# EAGLE design Gamma PIN V2 (EAGLE 9.0.1)
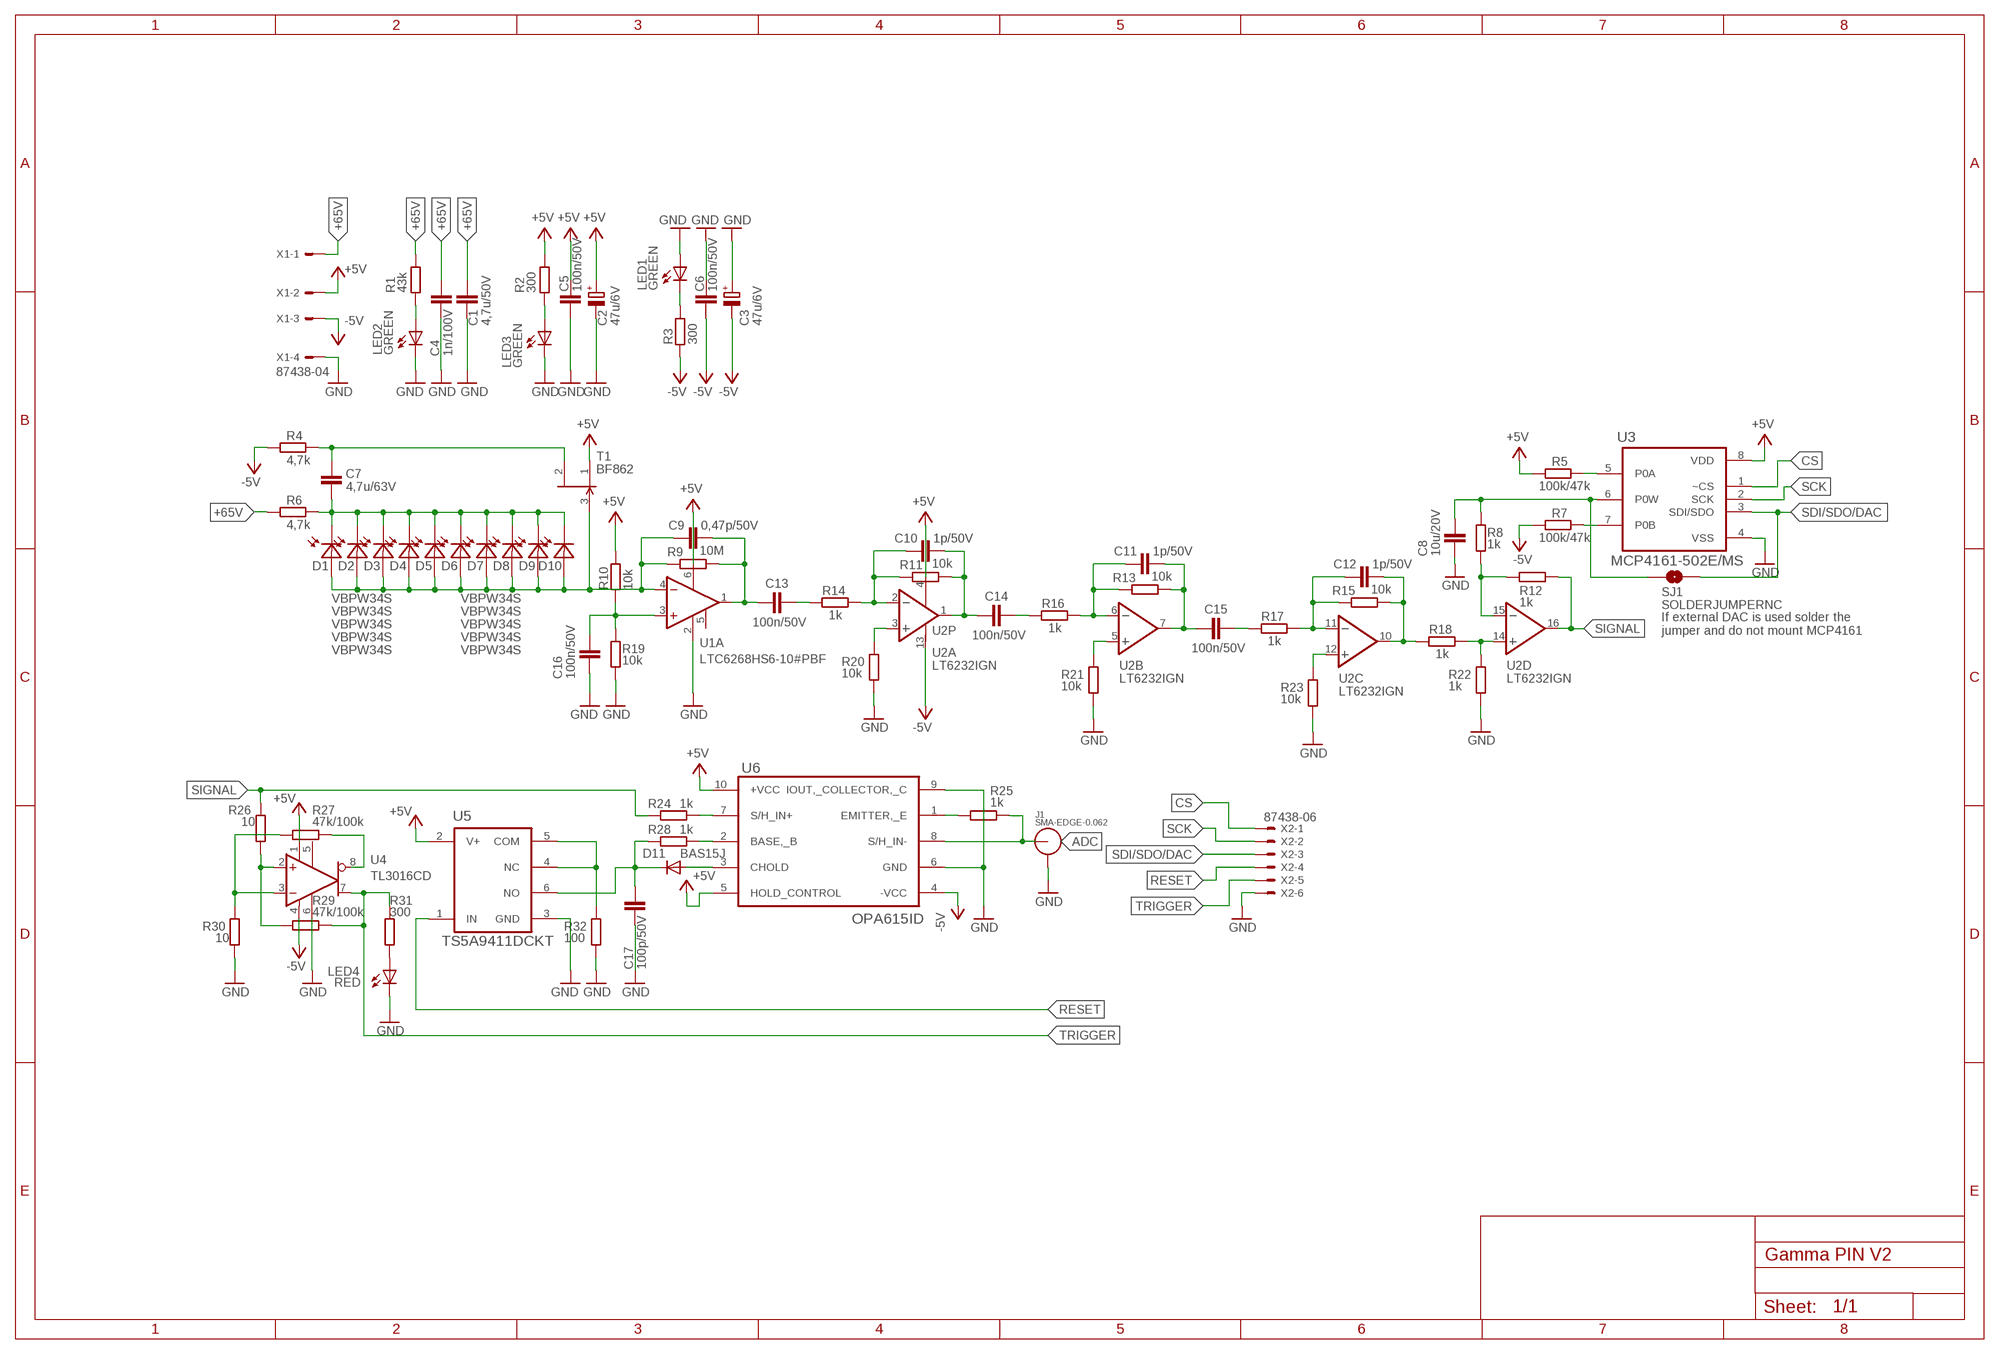
[diagram p0: schematic, sheet 1]

## Parts
C1  4,7u/50V  C-EUC1206  [C1206]
C2  47u/6V  CPOL-EUSMCB  [SMC_B]
C3  47u/6V  CPOL-EUSMCB  [SMC_B]
C4  1n/100V  C-EUC0603  [C0603]
C5  100n/50V  C-EUC0603  [C0603]
C6  100n/50V  C-EUC0603  [C0603]
C7  4,7u/63V  C-EUC1206  [C1206]
C8  10u/20V  C-EUC0603  [C0603]
C9  0,47p/50V  C-EUC0603  [C0603]
C10  1p/50V  C-EUC0603  [C0603]
C11  1p/50V  C-EUC0603  [C0603]
C12  1p/50V  C-EUC0603  [C0603]
C13  100n/50V  C-EUC0603  [C0603]
C14  100n/50V  C-EUC0603  [C0603]
C15  100n/50V  C-EUC0603  [C0603]
C16  100n/50V  C-EUC0603  [C0603]
C17  100p/50V  C-EUC0603  [C0603]
D1  VBPW34S  [SOD6439X130N]
D2  VBPW34S  [SOD6439X130N]
D3  VBPW34S  [SOD6439X130N]
D4  VBPW34S  [SOD6439X130N]
D5  VBPW34S  [SOD6439X130N]
D6  VBPW34S  [SOD6439X130N]
D7  VBPW34S  [SOD6439X130N]
D8  VBPW34S  [SOD6439X130N]
D9  VBPW34S  [SOD6439X130N]
D10  VBPW34S  [SOD6439X130N]
D11  BAS15J  DIODE-SC79_INFINEON  [SC79_INFINEON]
J1  SMA-EDGE-0.062  LINX-SMA-EDGE-0.062  [CONSMA003.062]
LED1  GREEN  LEDCHIPLED_0603  [CHIPLED_0603]
LED2  GREEN  LEDCHIPLED_0603  [CHIPLED_0603]
LED3  GREEN  LEDCHIPLED_0603  [CHIPLED_0603]
LED4  RED  LEDCHIPLED_0603  [CHIPLED_0603]
R1  43k  R-EU_R0603  [R0603]
R2  300  R-EU_R0603  [R0603]
R3  300  R-EU_R0603  [R0603]
R4  4,7k  R-EU_R0603  [R0603]
R5  100k/47k  R-EU_R0603  [R0603]
R6  4,7k  R-EU_R0603  [R0603]
R7  100k/47k  R-EU_R0603  [R0603]
R8  1k  R-EU_R0603  [R0603]
R9  10M  R-EU_R0603  [R0603]
R10  10k  R-EU_R0603  [R0603]
R11  10k  R-EU_R0603  [R0603]
R12  1k  R-EU_R0603  [R0603]
R13  10k  R-EU_R0603  [R0603]
R14  1k  R-EU_R0603  [R0603]
R15  10k  R-EU_R0603  [R0603]
R16  1k  R-EU_R0603  [R0603]
R17  1k  R-EU_R0603  [R0603]
R18  1k  R-EU_R0603  [R0603]
R19  10k  R-EU_R0603  [R0603]
R20  10k  R-EU_R0603  [R0603]
R21  10k  R-EU_R0603  [R0603]
R22  1k  R-EU_R0603  [R0603]
R23  10k  R-EU_R0603  [R0603]
R24  1k  R-EU_R0603  [R0603]
R25  1k  R-EU_R0603  [R0603]
R26  10  R-EU_R0603  [R0603]
R27  47k/100k  R-EU_R0603  [R0603]
R28  1k  R-EU_R0603  [R0603]
R29  47k/100k  R-EU_R0603  [R0603]
R30  10  R-EU_R0603  [R0603]
R31  300  R-EU_R0603  [R0603]
R32  100  R-EU_R0603  [R0603]
SJ1  SOLDERJUMPERNC  [SJ_2S_SMALL]
T1  BF862  [SOT23]
U1  LTC6268HS6-10#PBF  LTC6268HS6-10#PBFTSOT-23  [TSOT23-6]
U2  LT6232IGN  [SSOP16]
U3  MCP4161-502E/MS  [MSOP8]
U4  TL3016CD  [TSSOP8]
U5  TS5A9411DCKT  [SOT65P210X110-6N]
U6  OPA615ID  [MSOP10]
X1  87438-04  [87438-04]
X2  87438-06  [87438-06]

## Nets
+5V: C2.+ C5.2 R2.2 R5.1 R10.2 T1.1(S) U1.6(VDD) U2.4(P:V+) U3.8(VDD) U4.1(V+) U5.2(V+) U6.5(HOLD_CONTROL) U6.10(+VCC) X1.2
+65V: C1.1 C4.2 R1.2 R6.1 X1.1
-5V: C3.- C6.1 R3.1 R4.1 R7.1 U2.13(P:V-) U4.4(V-) U6.4(-VCC) X1.3
ADC: J1.ANT R25.1 U6.8(S/H_IN-)
CS: U3.1(~CS) X2.1
GND: C1.2 C2.- C3.+ C4.1 C5.1 C6.2 C8.2 C16.1 C17.1 J1.GND1 J1.GND2 J1.GND3 J1.GND4 LED1.A LED2.C LED3.C LED4.C R19.1 R20.2 R21.2 R22.2 R23.2 R30.1 R32.2 U1.2(GND) U3.4(VSS) U4.6(GND) U5.3(GND) U6.6(GND) U6.9(IOUT,_COLLECTOR,_C) X1.4 X2.6
N$1: R8.2 R12.2 U2.15(D:-IN)
N$2: C7.2 R4.2 T1.2(D)
N$3: C16.2 R10.1 R19.2 U1.3(A:+IN)
N$4: C7.1 D1.C D2.C D3.C D4.C D5.C D6.C D7.C D8.C D9.C D10.C R6.2
N$5: R27.2 R30.2 U4.3(-IN)
N$6: C9.2 D1.A D2.A D3.A D4.A D5.A D6.A D7.A D8.A D9.A D10.A R9.2 T1.3(G) U1.4(A:-IN)
N$7: C9.1 C13.2 R9.1 U1.1(A:OUT)
N$8: C13.1 R14.2
N$9: C15.1 R17.2
N$10: C12.1 R15.1 R18.2 U2.10(C:OUT)
N$11: C14.1 R16.2
N$12: R20.1 U2.3(A:+IN)
N$13: C10.2 R11.2 R14.1 U2.2(A:-IN)
N$14: C10.1 C14.2 R11.1 U2.1(A:OUT)
N$15: C11.2 R13.2 R16.1 U2.6(B:-IN)
N$16: R18.1 R22.1 U2.14(D:+IN)
N$17: C11.1 C15.2 R13.1 U2.7(B:OUT)
N$18: R21.1 U2.5(B:+IN)
N$19: C12.2 R15.2 R17.1 U2.11(C:-IN)
N$20: C8.1 R8.1 SJ1.1 U3.6(P0W)
N$21: R23.1 U2.12(C:+IN)
N$22: R5.2 U3.5(P0A)
N$23: R7.2 U3.7(P0B)
N$24: R24.1 U6.7(S/H_IN+)
N$25: D11.A U6.3(CHOLD)
N$26: R28.1 U6.2(BASE,_B)
N$27: LED2.A R1.1
N$28: LED4.A R31.1
N$29: LED3.A R2.1
N$30: LED1.C R3.2
N$31: R32.1 U5.4(NC) U5.5(COM)
N$35: R25.2 U6.1(EMITTER,_E)
N$40: R27.1 U4.8(*QOUT)
N$41: R26.2 R29.2 U4.2(+IN)
N$43: C17.2 D11.C R28.2 U5.6(NO)
RESET: U5.1(IN) X2.4
SCK: U3.2(SCK) X2.2
SDI/SDO/DAC: SJ1.2 U3.3(SDI/SDO) X2.3
SIGNAL: R12.1 R24.2 R26.1 U2.16(D:OUT)
TRIGGER: R29.1 R31.2 U4.7(QOUT) X2.5
Unconnected: U1.5(A:SHDN) U4.5(LATCH)

## Notes on the sheet
- If external DAC is used solder the
  jumper and do not mount MCP4161

## Library data of the parts
C1 C5 C6 C8-C17 = rcl:C-EU: CAPACITOR, European symbol; SPICEPREFIX: C
C2 C3 = rcl:CPOL-EU: POLARIZED CAPACITOR, European symbol
C4 C7 = rcl:C-EU: CAPACITOR, European symbol
D1-D10 = VBPW34S:VBPW34S: VBPW34SR Series 60 V 940 nm 50 mA 215 mW Surface Mount Silicon PIN Photodiode; AVAILABILITY: Good; DESCRIPTION: VBPW34SR Series 60 V 940 nm 50 mA 215 mW Surface Mount Silicon PIN Photodiode; MF: Vishay; MP: VBPW34S; PACKAGE: SMD-2 Vishay; PRICE: 0.57 USD
D11 = diode:DIODE-: DIODE
J1 = connector:LINX-SMA-EDGE-0.062: CONN SMA JACK 50 OHM EDGE MNT; DIGIKEY: CONSMA003.062-ND
LED1-LED4 = led:LED: LED OSRAM: - CHIPLED LG R971, LG N971, LY N971, LG Q971, LY Q971, LO R971, LY R971 LH N974, LH R974 LS Q976, LO Q976, LY Q976 LO Q996 - Hyper CHIPLED LW Q18S LB Q993, LB Q99A, LB R99A - SideLED LS A670, LO A670, LY A670, LG A670, LP A670 LB A673, LV A673, LT A673, LW A673 LH A674 LY A675 LS A676, LA A676, LO A676, LY A676, LW A676 LS A679, LY A679, LG A679 - Hyper Micro SIDELED® LS Y876, LA Y876, LO Y876, LY Y876 LT Y87S - SmartLED LW L88C, LW L88S LB L89C, LB L89S, LG L890 LS L89K, LO L89K, LY L89K LS L896, LA L896, LO L896, LY L896 - TOPLED LS T670, LO T670, LY T670, LG T670, LP T670 LSG T670, LSP T670, LSY T670, LOP T670, LYG T670 LG T671, LOG T671, LSG T671 LB T673, LV T673, LT T673, LW T673 LH T674 LS T676, LA T676, LO T676, LY T676, LB T676, LH T676, LSB T676, LW T676 LB T67C, LV T67C, LT T67C, LS T67K, LO T67K, LY T67K, LW E67C LS E67B, LA E67B, LO E67B, LY E67B, LB E67C, LV E67C, LT E67C LW T67C LS T679, LY T679, LG T679 LS T770, LO T770, LY T770, LG T770, LP T770 LB T773, LV T773, LT T773, LW T773 LH T774 LS E675, LA E675, LY E675, LS T675 LS T776, LA T776, LO T776, LY T776, LB T776 LHGB T686 LT T68C, LB T68C - Hyper Mini TOPLED® LB M676 - Mini TOPLED Santana® LG M470 LS M47K, LO M47K, LY M47K Source: http://www.osram.convergy.de LUXEON: - LUMILED® LXK2-PW12-R00, LXK2-PW12-S00, LXK2-PW14-U00, LXK2-PW14-V00 LXK2-PM12-R00, LXK2-PM12-S00, LXK2-PM14-U00 LXK2-PE12-Q00, LXK2-PE12-R00, LXK2-PE12-S00, LXK2-PE14-T00, LXK2-PE14-U00 LXK2-PB12-K00, LXK2-PB12-L00, LXK2-PB12-M00, LXK2-PB14-N00, LXK2-PB14-P00, LXK2-PB14-Q00 LXK2-PR12-L00, LXK2-PR12-M00, LXK2-PR14-Q00, LXK2-PR14-R00 LXK2-PD12-Q00, LXK2-PD12-R00, LXK2-PD12-S00 LXK2-PH12-R00, LXK2-PH12-S00 LXK2-PL12-P00, LXK2-PL12-Q00, LXK2-PL12-R00 Source: www.luxeon.com KINGBRIGHT: KA-3528ASYC Source: www.kingbright.com
R1-R32 = rcl:R-EU_: RESISTOR, European symbol
SJ1 = headers:SOLDERJUMPER: Solder Jumper Standard SMD solder jumper. Used to automate production. Two varients : Normally Open and Normally Closed are the same, but have different paste layers. NC will have a large amount of paste and should jumper during reflow.
T1 = BF862:BF862: Silicon n-channel symmetric junction field effect transistor; AVAILABILITY: Unavailable; DESCRIPTION: Trans JFET N-CH 20V 40mA Si 3-Pin TO-236AB; MF: NXP Semiconductors; MP: BF862; PACKAGE: None; PRICE: None
U1 = LTC6268HS6-10_PBF:LTC6268HS6-10#PBF: LTC6268 - 500MHz Ultra-Low Bias Current FET Input Op Amp
U2 = linear-technology:LT6232: 215MHz, Rail-to-Rail Output, 1.1nV/Hz, 3.5mA Op Amp Source: http://cds.linear.com/docs/Datasheet/623012fb.pdf; MPN: LT6232IGN; OC_FARNELL: unknown; OC_NEWARK: 57M9364
U3 = Microchip_By_element14_Batch_1:MCP4161-502E/MS
U4 = Texas Instruments_By_element14_Batch_1:TL3016CD: PRECISION COMPARATORS
U5 = Texas Instruments_By_element14_Batch_1:TS5A9411DCKT: SPDT ANALOG SWITCH; MPN: TS5A9411DCKT; OC_FARNELL: 1755582; OC_NEWARK: 34R9273; PACKAGE: SC-70-6; SUPPLIER: Texas Instruments
U6 = Texas Instruments_By_element14_Batch_1:OPA615ID: Wide-Bandwidth, DC Restoration Circuit
X1 = con-molex:87438-04: Wire-to-Board 1.50mm (.059") Pitch Header - Right Angle, SMT, Shrouded Source: http://www.molex.com/product/micro/87438.html; MF: MOLEX; OC_FARNELL: unknown; OC_NEWARK: unknown
X2 = con-molex:87438-06: Wire-to-Board 1.50mm (.059") Pitch Header - Right Angle, SMT, Shrouded Source: http://www.molex.com/product/micro/87438.html; MF: MOLEX; MPN: 87438-0643; OC_FARNELL: 1756938; OC_NEWARK: 88K3155

## Board
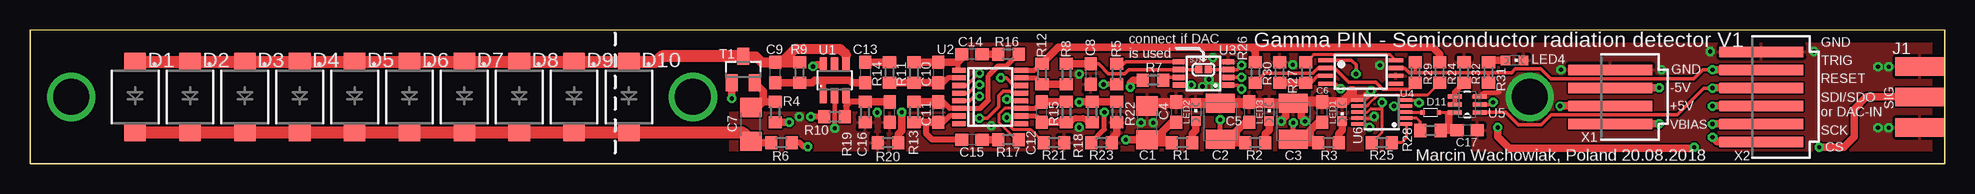
[diagram p1: board, top side]
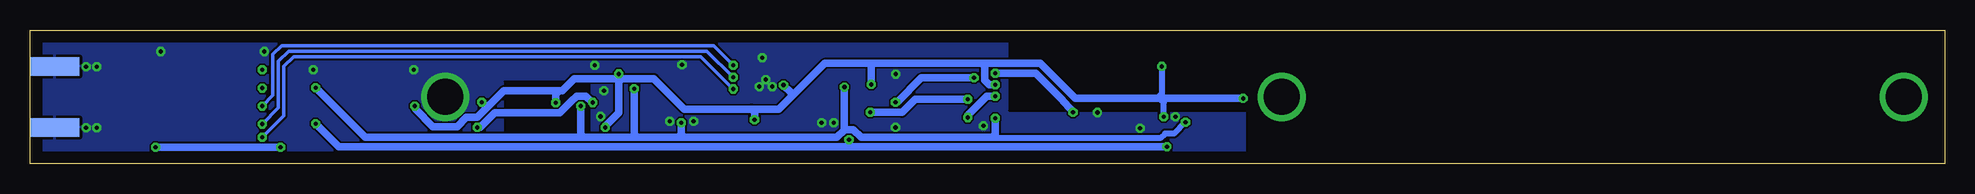
[diagram p2: board, bottom side, seen from below]

Size 159.56 x 11.17 mm. Coordinates in mm from the lower left corner, seen from the top.
Outline: 0,0 159.56,0 159.56,11.17 0,11.17 0,0
Copper layers (1*16): Top 0.035mm / dielectric 1.5mm / Bottom 0.035mm
Design rules "default": minimum track width 6mil, minimum drill 0.35mm, track to track 6mil, track to pad 6mil, pad to pad 6mil, via to via 6mil, smd to smd 6mil, copper to edge 40mil, drill to drill 6mil, minimum pad ring 10mil, minimum via ring 8mil, stop-mask expansion 4mil, vias tented up to drill 0mil, thermal gap 10mil

### Footprints (pad centres in the part's own frame; a part is rotated, then mirrored left to right if it is on the bottom)
C1206 = smd 1.6 x 1.8: 1 -1.4,0; 2 1.4,0
SMC_B = smd 1.6 x 2.4: + -1.5,0; - 1.5,0
C0603 = smd 1.1 x 1: 1 -0.85,0; 2 0.85,0
SOD6439X130N = smd 1.5 x 1.8: A 2.95,0; C -2.95,0
SC79_INFINEON = smd 0.35 x 0.35: A 0.675,0; C -0.675,0
CONSMA003.062 = smd 4.06 x 1.52: ANT 0,0; GND1 0,2.54; GND2 0,-2.54 | smd 4.06 x 1.52 bottom: GND3 0,2.54; GND4 0,-2.54
CHIPLED_0603 = smd 0.8 x 0.8: A 0,-0.75; C 0,0.75
R0603 = smd 1 x 1.1: 1 -0.85,0; 2 0.85,0
SJ_2S_SMALL = smd 0.6 x 0.6: 1 -0.4,0; 2 0.4,0
SOT23 = smd 1 x 1.4: 1 -0.95,-1.1; 2 0.95,-1.1; 3 0,1.1
TSOT23-6 = smd 0.62 x 1.22: 1 -0.95,-1.3; 2 0,-1.3; 3 0.95,-1.3; 4 0.95,1.3; 5 0,1.3; 6 -0.95,1.3
SSOP16 = smd 0.419 x 1.143: 1 -2.223,-2.6; 2 -1.587,-2.6; 3 -0.953,-2.6; 4 -0.318,-2.6; 5 0.318,-2.6; 6 0.953,-2.6; 7 1.587,-2.6; 8 2.223,-2.6; 9 2.223,2.6; 10 1.587,2.6; 11 0.953,2.6; 12 0.318,2.6; 13 -0.318,2.6; 14 -0.953,2.6; 15 -1.587,2.6; 16 -2.223,2.6
MSOP8 = smd 0.45 x 1: 1 -0.975,-2.05; 2 -0.325,-2.05; 3 0.325,-2.05; 4 0.975,-2.05; 5 0.975,2.05; 6 0.325,2.05; 7 -0.325,2.05; 8 -0.975,2.05
TSSOP8 = smd 1.2 x 0.35: 1 -2.925,0.975; 2 -2.925,0.325; 3 -2.925,-0.325; 4 -2.925,-0.975; 5 2.925,-0.975; 6 2.925,-0.325; 7 2.925,0.325; 8 2.925,0.975
SOT65P210X110-6N = smd 1.168 x 0.356: 1 -1.041,0.66; 2 -1.041,0; 3 -1.041,-0.66; 4 1.041,-0.66; 5 1.041,0; 6 1.041,0.66
MSOP10 = smd 0.3 x 1: 1 -1,-2.05; 2 -0.5,-2.05; 3 0,-2.05; 4 0.5,-2.05; 5 1,-2.05; 6 1,2.05; 7 0.5,2.05; 8 0,2.05; 9 -0.5,2.05; 10 -1,2.05
87438-04 = smd 7 x 0.85: 1 0,2.25; 2 0,0.75; 3 0,-0.75; 4 0,-2.25
87438-06 = smd 7 x 0.85: 1 0,3.75; 2 0,2.25; 3 0,0.75; 4 0,-0.75; 5 0,-2.25; 6 0,-3.75

### Placement (x,y rotation side)
C1  93.09,3.43 90 top
C2  99.19,3.56 90 top
C3  105.28,3.56 270 top
C4  95.5,4.32 270 top
C5  101.6,4.32 270 top
C6  107.7,4.32 90 top
C7  60.07,3.3 90 top
C8  88.39,7.49 270 top
C9  62.1,7.62 90 top
C10  75.69,7.62 270 top
C11  75.69,4.32 90 top
C12  84.33,4.32 90 top
C13  69.6,7.62 270 top
C14  78.49,9.14 180 top
C15  78.49,2.03 180 top
C16  71.63,4.32 90 top
C17  119.76,2.79 180 top
D1  8.76,5.58 90 top
D2  13.33,5.58 90 top
D3  17.91,5.58 90 top
D4  22.48,5.58 90 top
D5  27.05,5.58 90 top
D6  31.62,5.58 90 top
D7  36.19,5.58 90 top
D8  40.77,5.58 90 top
D9  45.34,5.58 90 top
D10  49.91,5.58 90 top
D11  116.71,4.29 180 top
J1  157.48,5.59 0 top
LED1  109.35,4.32 180 top
LED2  97.16,4.32 0 top
LED3  103.25,4.32 0 top
LED4  123.72,8.64 270 top
R1  96.01,1.78 180 top
R2  102.11,1.78 180 top
R3  108.2,1.78 0 top
R4  62.1,4.32 90 top
R5  90.55,7.49 90 top
R6  62.61,1.78 180 top
R7  93.6,6.99 0 top
R8  86.36,7.49 270 top
R9  64.13,7.62 90 top
R10  67.06,3.94 180 top
R11  73.66,7.62 270 top
R12  84.33,7.49 270 top
R13  73.66,4.32 90 top
R14  71.63,7.62 90 top
R15  86.36,4.32 90 top
R16  81.53,9.14 180 top
R17  81.53,2.03 180 top
R18  88.52,4.32 270 top
R19  69.6,4.32 90 top
R20  71.5,1.78 180 top
R21  85.34,1.78 0 top
R22  90.55,4.32 270 top
R23  89.28,1.78 0 top
R24  117.47,7.62 90 top
R25  112.65,1.78 0 top
R26  102.11,7.62 270 top
R27  106.32,7.62 270 top
R28  116.71,2.79 0 top
R29  115.44,7.62 270 top
R30  104.14,7.62 270 top
R31  121.54,7.62 270 top
R32  119.51,7.62 90 top
SJ1  97.79,7.87 0 top
T1  59.44,7.87 0 top
U1  67.06,6.99 0 top
U2  80.01,5.59 270 top
U3  97.79,7.54 90 top
U4  110.9,7.67 0 top
U5  119.76,4.95 180 top
U6  112.65,4.32 90 top
X1  131.7,5.59 180 top
X2  144.27,5.59 180 top

### Tracks (layer width: path | path; a pad name or v marks a point on that pad's centre or on a via)
+5V  (via drill 0.35)
  Top 0.254: U6.10 111.34,3.32 111.36,3.3 111.38,3.3 v111.63,3.05 | U6.5 115.53,5.32 v115.75,5.11
  Top 0.305: U2.4 78.17,5.91 78.87,6.6 v79.12,6.6 | U4.1 110.12,8.65 110.5,8.27 v110.5,7.51 110.5,7.73 | U5.2 121.69,4.95 v121.92,5.16
  Top 0.406: C2.+ v99.19,3.68 | U3.8 96.64,6.57 v96.77,6.58 | R5.1 89.57,6.64 v89.46,6.63
  Top 0.508: R10.2 v65.08,3.94
  Top 0.61: T1.1 58.49,5.48 v58.47,5.46 | R2.2 100.71,1.78 | 100.71,1.78 99.95,1.78 | 99.95,1.78 99.47,1.78 C2.+ | C5.2 101.26,3.47 100.52,2.73 | U1.6 65.56,8.29 v65.25,8.13 | X1.2 127.52,4.84 v127.51,4.83 | 100.52,2.73 99.95,2.16 99.95,1.78 | 100.71,1.78 100.52,1.97 100.52,2.73
  Bottom 0.508: v65.08,3.94 65.08,5.13 65.25,5.31 | 65.25,5.31 65.41,5.46 | v65.25,8.13 65.25,5.84 | 65.25,5.84 65.25,5.31 | 65.25,5.84 65.63,5.46 65.66,5.46
  Bottom 0.61: v58.47,5.46 65.41,5.46 65.66,5.46 72.45,5.46 75.39,8.39 80.25,8.39 | v79.12,6.6 79.63,6.6 80.01,6.99 80.01,8.15 80.25,8.39 | v89.46,6.63 89.46,8.18 89.25,8.39 | 80.25,8.39 80.26,8.38 | 80.25,8.39 89.25,8.39 | v111.63,3.05 111.63,3.16 110.5,4.29 110.5,6.87 110.26,7.11 | v127.51,4.83 127.43,4.83 127.43,4.57 125.99,3.12 123.95,3.12 123.19,3.88 122.3,3.88 121.32,4.86 | 89.25,8.39 93.33,8.39 96.01,5.71 | 99.44,4.57 105.03,4.57 107.57,7.11 110.26,7.11 | 99.44,4.57 97.16,4.57 96.14,5.59 | 96.01,5.71 96.14,5.59 | 96.01,5.82 96.01,5.71 | 110.26,7.11 114.21,7.11 115.21,6.12 115.44,6.12 | v110.5,7.51 110.5,7.35 110.26,7.11 | 121.32,4.86 120.07,6.12 115.44,6.12 | v121.92,5.16 121.62,4.86 121.32,4.86 | v96.77,6.58 96.14,5.94 96.14,5.59 | v99.19,3.68 99.19,4.32 99.44,4.57 | v115.75,5.11 115.75,5.81 115.44,6.12
+65V  (via drill 0.35)
  Top 0.508: v64.82,1.45 64.47,1.45 64.13,1.78 R6.1
  Top 0.61: C1.1 93.37,1.78 94.36,1.78 | 94.36,1.78 R1.2 | C1.1 93.07,2.03 v91.31,2.03 | 131.79,3.3 X1.1 135.74,3.34 v135.76,3.37 | C1.1 93.72,2.03 93.79,2.1 94.36,2.67 | 94.36,1.78 94.36,2.67 | C4.2 95.16,3.47 94.36,2.67
  Bottom 0.61: v91.31,2.03 91.31,1.7 91.57,1.45 | v135.76,3.37 133.84,1.45 91.57,1.45 | 91.57,1.45 v64.82,1.45
-5V  (via drill 0.35)
  Top 0.254: U6.4 114.05,4.82 v113.66,4.83
  Top 0.305: U2.13 81.86,5.91 81.69,6.08 81.12,6.08 80.72,5.68 80.72,4.76 79.77,3.81 v79.12,3.81 | U4.4 108.8,6.7 v109.22,6.28
  Top 0.406: C3.- v105.28,3.43
  Top 0.61: 106.55,1.78 105.56,1.78 C3.- 105.56,2.06 105.79,2.29 106.17,2.29 107.35,3.47 C6.1 | 106.55,1.78 R3.1 | 106.55,1.78 106.68,1.9 106.68,2.79 | X1.3 131.71,6.35 v135.76,6.35 | 62.27,3.47 R4.1 v63.27,3.48 | v91.69,6.41 91.69,6.73 91.95,6.99 R7.1
  Bottom 0.508: 83.19,2.21 83.13,2.16 65.36,2.16 64.97,2.54 64.21,2.54 v63.27,3.48
  Bottom 0.61: v79.12,3.81 79.12,2.46 79.38,2.21 83.19,2.21 90.31,2.21 90.97,2.87 91.66,2.87 91.69,2.83 | 105.03,2.21 92.32,2.21 91.69,2.83 | 105.03,2.21 105.54,2.21 | 105.28,2.46 105.03,2.21 | v105.28,3.43 105.28,2.46 | 105.28,2.46 105.54,2.21 | v135.76,6.35 131.62,2.21 113.39,2.21 | 105.54,2.21 108.97,2.21 | 108.97,2.21 113.39,2.21 | 91.66,6.37 v91.69,6.41 91.69,2.83 | 108.97,2.21 109.22,2.46 v109.22,6.28 | v113.66,4.83 113.66,2.49 113.39,2.21
ADC  (via drill 0.35)
  Top 0.254: U6.8 111.44,4.32 111.74,4.61 112.55,4.61 112.67,4.5 | 112.59,4.61 112.67,4.7 | R25.1 112.67,2.65 112.67,4.5 | 112.67,4.5 112.67,4.7 | 112.67,4.7 v112.67,5.12 v112.67,5.13
  Top 0.61: 149.15,1.32 149.1,1.32 v149.1,1.39 151.13,1.39 152.02,2.29 152.02,4.57 153.03,5.59 J1.ANT | v138.68,1.39 138.61,1.32 123.27,1.32 122.3,2.29 v122.3,3.04
  Bottom 0.61: v138.68,1.39 v149.1,1.39 | v122.3,3.04 122.06,3.04 120.83,4.27 115.4,4.27 114.5,5.17 114.01,5.66 113.23,5.66 112.7,5.13 v112.67,5.13
CS  (via drill 0.35)
  Top 0.305: U3.1 100.64,6.57 v100.97,6.25
  Top 0.61: X2.1 140.6,1.84 v140.21,2.23
  Bottom 0.305: v100.97,6.25 103.67,8.96 137.6,8.96 138.41,8.15 138.41,4.03 v140.21,2.23
GND  (via drill 0.35, 3)
  Top 0.254: U6.9 111.88,3.82 v112.01,3.96
  Top 0.305: 110.6,5.36 U6.6 110.92,5.64 111.06,5.64 111.09,5.67 111.3,5.67
  Top 0.356: U5.3 121.13,5.94 122.23,5.94 122.25,5.97 122.45,5.97
  Top 0.381: U1.2 67.06,3.17 66.93,3.05
  Top 0.61: C3.+ 104.88,5.06 104.65,4.83 | 104.45,4.63 104.65,4.83 | v106.25,3.56 106.12,3.69 106.12,3.78 105.92,3.97 105.92,5.17 | v104.27,3.56 104.45,3.74 104.45,3.78 104.65,3.97 104.65,4.83 | 109.77,5.49 111.12,5.49 111.3,5.67 111.73,6.1 111.82,6.1 111.85,6.13 111.75,6.13 v111.73,6.11 | R23.2 90.13,2.12 90.55,2.54 R22.2
  Top 0.813: LED1.A 110.16,5.88 110.16,6.1 | C3.+ 105.39,5.17 105.92,5.17 C6.2 109.45,5.17 | 104.88,5.06 104.87,5.07 LED3.C 99.2,5.07 C2.- 93.32,5.06 C1.2
  other vias: 92.58,3.43 93.6,3.43 87.43,7.49 87.44,3.05 124.97,5.59 80.11,3.17 127.58,7.85 105.23,8.27 64.11,3.94 67.06,2.97 70.61,4.29 112.5,8.23 135.97,7.85 98.78,6.45 148.67,9.37 140.03,9.37 154.89,8.1 154,8.1 154.89,3.02 154,3.02 98.55,8.86 97.71,6.45 98.25,7.04
  pour Bottom (isolate 0.102): -0.25,11.3 159.83,11.3 159.83,-0.13 -0.25,-0.13
  pour Top (isolate 0.102): -0.51,11.56 160.08,11.56 160.08,-0.38 -0.51,-0.38
N$1
  Top 0.406: U2.15 83.8,7.18 R12.2
  Top 0.61: R8.2 R12.2
N$2
  Top 0.61: 61.09,5.17 R4.2 | T1.2 61.09,6.07 61.09,5.17 | C7.2 60.62,4.7 61.09,5.17
N$3
  Top 0.508: U1.3 68.01,4.83 | 68.01,4.83 68.01,4.04 R10.1 | R19.2 68.35,5.17 68.01,4.83
  Top 0.61: C16.2 R19.2
N$4
  Top 0.152: D10.C 49.99,2.56
  Top 0.61: R6.2 60.2,1.78 C7.1
  Top 1.016: D1.C D2.C D3.C D4.C D5.C D6.C D7.C D8.C D9.C D10.C 58.55,2.63 59.24,2.63 59.34,2.63 C7.1
N$5
  Top 0.305: R27.2 106.75,6.77 107.33,7.35 U4.3
  Top 0.61: R27.2 R30.2
N$6
  Top 0.61: C9.2 62.23,8.47 | 68.01,9.08 U1.4
  Top 0.813: T1.3 60.49,8.97 61,8.47 62.23,8.47 62.64,8.47 | 62.64,8.47 R9.2 | 62.64,8.47 63.77,9.6 67.49,9.6 68.01,9.08
  Top 1.016: D1.A D2.A D3.A D4.A D5.A D6.A D7.A D8.A D9.A D10.A 52.22,8.53 52.66,8.97 T1.3
N$7
  Top 0.508: U1.1 66.11,6.67 65.79,6.99
  Top 0.61: C9.1 R9.1 65.19,6.77 65.41,6.99 65.79,6.99 68.33,6.99 68.54,6.77 C13.2
N$8
  Top 0.61: C13.1 R14.2
N$9
  Top 0.61: C15.1 R17.2
N$10
  Top 0.406: U2.10 83.8,4 C12.1
  Top 0.508: R15.1 86.75,3.47 87.11,3.83 87.76,3.83 88.13,3.47 R18.2
  Top 0.61: R15.1 C12.1
N$11
  Top 0.61: C14.1 R16.2
N$12  (via drill 0.35)
  Top 0.305: U2.3 78.04,6.54 79.06,7.56 v79.12,7.56
  Top 0.61: 72.48,1.9 R20.1 72.35,2.49 72.64,2.79 v72.64,4.32
  Bottom 0.61: v79.12,7.56 75.76,7.56 73.66,5.46 v72.64,4.32
N$13
  Top 0.406: U2.2 76.52,7.18 76.11,6.77 C10.2
  Top 0.61: R14.1 R11.2 C10.2
N$14
  Top 0.406: 77.3,8.47 77.3,7.92 U2.1
  Top 0.61: R11.1 C10.1 77.3,8.47 77.64,8.8 C14.2
N$15
  Top 0.406: C11.2 76.11,5.17 76.64,4.64 U2.6 79.18,4.64 79.86,5.31 79.86,7.34 80.64,8.13 81.37,8.13 R16.1 | 82.38,8.98 R16.1 | 82.38,8.87 R16.1
  Top 0.61: C11.2 R13.2
N$16  (via drill 0.35)
  Top 0.305: U2.14 81.98,6.54 81.34,7.18 v80.9,7.18
  Top 0.61: R22.1 R18.1 87.47,5.17 v87.44,5.14
  Bottom 0.61: v80.9,7.18 85.28,7.18 87.31,5.14 v87.44,5.14
N$17
  Top 0.406: U2.7 76.64,4 76.11,3.47 C11.1
  Top 0.508: 74.68,3.47 74.68,2.54 75.18,2.03 C15.2
  Top 0.61: R13.1 74.68,3.47 C11.1
N$18  (via drill 0.35)
  Top 0.254: R21.1 83.39,2.88 81.92,2.88 81.76,3.04 81.76,3.52 v81.41,3.87
  Top 0.305: v79.12,5.65 78.68,5.65 78.3,5.27 U2.5
  Bottom 0.406: 81.41,3.94 v81.41,3.87
  Bottom 0.61: v79.12,5.65 79.82,5.65 81.41,4.06 81.41,3.94
N$19
  Top 0.254: R17.1 82.19,2.03 80.75,3.48 80.75,4.15 81.24,4.64 U2.11
  Top 0.406: U2.11 83.8,4.64 C12.2
  Top 0.61: R15.2 C12.2
N$20
  Top 0.305: C8.1 89.07,8.34 89.88,7.54 91.23,7.54 91.57,7.87 95.61,7.87 U3.6 96.88,7.87 SJ1.1
  Top 0.61: R8.1 C8.1
N$21  (via drill 0.35)
  Top 0.305: U2.12 81.53,5.27 v81.41,5.4
  Top 0.406: R23.1 89.53,2.88 v89.53,4.32
  Bottom 0.61: v89.53,4.32 89.48,4.31 86.88,4.31 85.79,5.4 v81.41,5.4
N$22
  Top 0.305: U3.5 95.22,8.51 91.31,8.51 91.15,8.34 R5.2
N$23
  Top 0.305: U3.7 94.05,7.22 R7.2
N$24
  Top 0.254: U6.7 111.38,4.83 111.57,5.02 112.34,5.78 113.92,5.78 114.43,5.78 116.49,5.78 R24.1
N$25
  Top 0.254: U6.3 116.01,4.32 D11.A
N$26
  Top 0.254: 114.71,3.81 U6.2 115.56,3.82 115.86,3.52 R28.1
N$27
  Top 0.61: LED2.A 97.16,2.79 96.86,2.5 R1.1
N$28
  Top 0.61: LED4.A 121.7,8.64 R31.1
N$29
  Top 0.61: R2.1 102.96,2.5 103.25,2.79 LED3.A
N$30
  Top 0.61: R3.2 109.05,2.5 109.35,2.79 LED1.C
N$31
  Top 0.356: 118.72,5.13 U5.5
  Top 0.406: R32.1 118.72,5.99 U5.4 118.72,5.13
N$32
  cutout Top: 112.9,6.86 120.02,6.86 120.02,1.02 112.9,1.02
N$33
  cutout Top: 0.13,11.05 77.98,11.05 77.98,4.45 58.17,4.45 58.17,0.13 0.13,0.13
N$35
  Top 0.254: U6.1 114.7,2.18 114.3,1.78 R25.2
N$36
  cutout Bottom: 0.38,10.67 77.98,10.67 77.98,4.45 58.17,4.45 58.17,0.25 0.38,0.25
N$37  (via drill 3)
  other vias: 3.43,5.59
N$38
  cutout Bottom: 112.9,6.86 120.02,6.86 120.02,1.02 112.9,1.02
N$40
  Top 0.254: R27.1 106.4,8.47 | 113.57,8.61 U4.8 113.35,9.12 106.97,9.12 R27.1 | R27.1 106.32,8.68
N$41
  Top 0.305: R26.2 102.91,7.58 106.91,7.58 107.33,8 U4.2 108.72,8 109.89,6.82 112.12,6.82 112.73,6.22 114.89,6.22 R29.2
N$43
  Top 0.254: D11.C 117.91,4.29 | 117.91,4.29 118.62,4.29 | 118.62,4.29 U5.6 | 117.91,4.29 118.08,4.12 118.24,4.12 118.44,4.12 118.62,4.29
  Top 0.61: C17.2 118.24,2.79 | 118.24,2.79 R28.2 | 118.24,2.79 118.24,4.12
NC  (via drill 3)
  other vias: 55.24,5.59
RESET  (via drill 0.35)
  Top 0.305: v140.21,6.33 139.47,6.33 137.25,4.11 126.76,4.11 125.93,3.27 124.01,3.27 122.99,4.29 U5.1
  Top 0.61: X2.4 140.22,6.34 v140.21,6.33
SCK  (via drill 0.35)
  Top 0.305: U3.2 v100.96,7.22 v100.97,7.23
  Top 0.61: X2.2 140.22,3.34 v140.21,3.33
  Bottom 0.305: v100.97,7.23 103.15,9.41 138.02,9.41 138.86,8.57 138.86,4.67 v140.21,3.33
SDI/SDO/DAC  (via drill 0.35)
  Top 0.305: U3.3 99.72,7.87 | U3.3 100.6,7.87 v100.97,8.24 | SJ1.2 U3.3
  Top 0.61: X2.3 140.22,4.84 v140.21,4.83
  Bottom 0.305: v100.97,8.24 102.6,9.87 138.59,9.87 139.32,9.14 139.32,5.71 v140.21,4.83
SIGNAL
  Top 0.406: U2.16 83.67,7.81 R12.1
  Top 0.61: R12.1 85.7,9.72 101.78,9.72 | R24.2 117.47,9.14 116.9,9.72 101.78,9.72 | 101.78,9.72 102.11,9.39 R26.1
TRIGGER  (via drill 0.35)
  Top 0.305: v140.21,7.85 139.4,7.85 138.66,7.11 126.72,7.11 125.9,7.92 123.78,7.92 123.48,7.62 121.39,7.62 | 115.29,7.62 114.94,7.62 114.56,8 U4.7 | 115.44,7.77 115.29,7.62 | 115.29,7.62 115.44,7.62 | 115.44,7.62 121.39,7.62 | R31.2 121.54,7.47 121.39,7.62 | R29.1 115.44,7.62
  Top 0.61: X2.5 140.22,7.84 v140.21,7.85

### Text on the board
tNames: Gamma PIN - Semiconductor radiation detector V1 | GND | connect if DAC / is used | TRIG | GND | RESET | -5V | +5V | SIG | SDI/SDO / or DAC-IN | VBIAS | SCK | CS | Marcin Wachowiak, Poland 20.08.2018